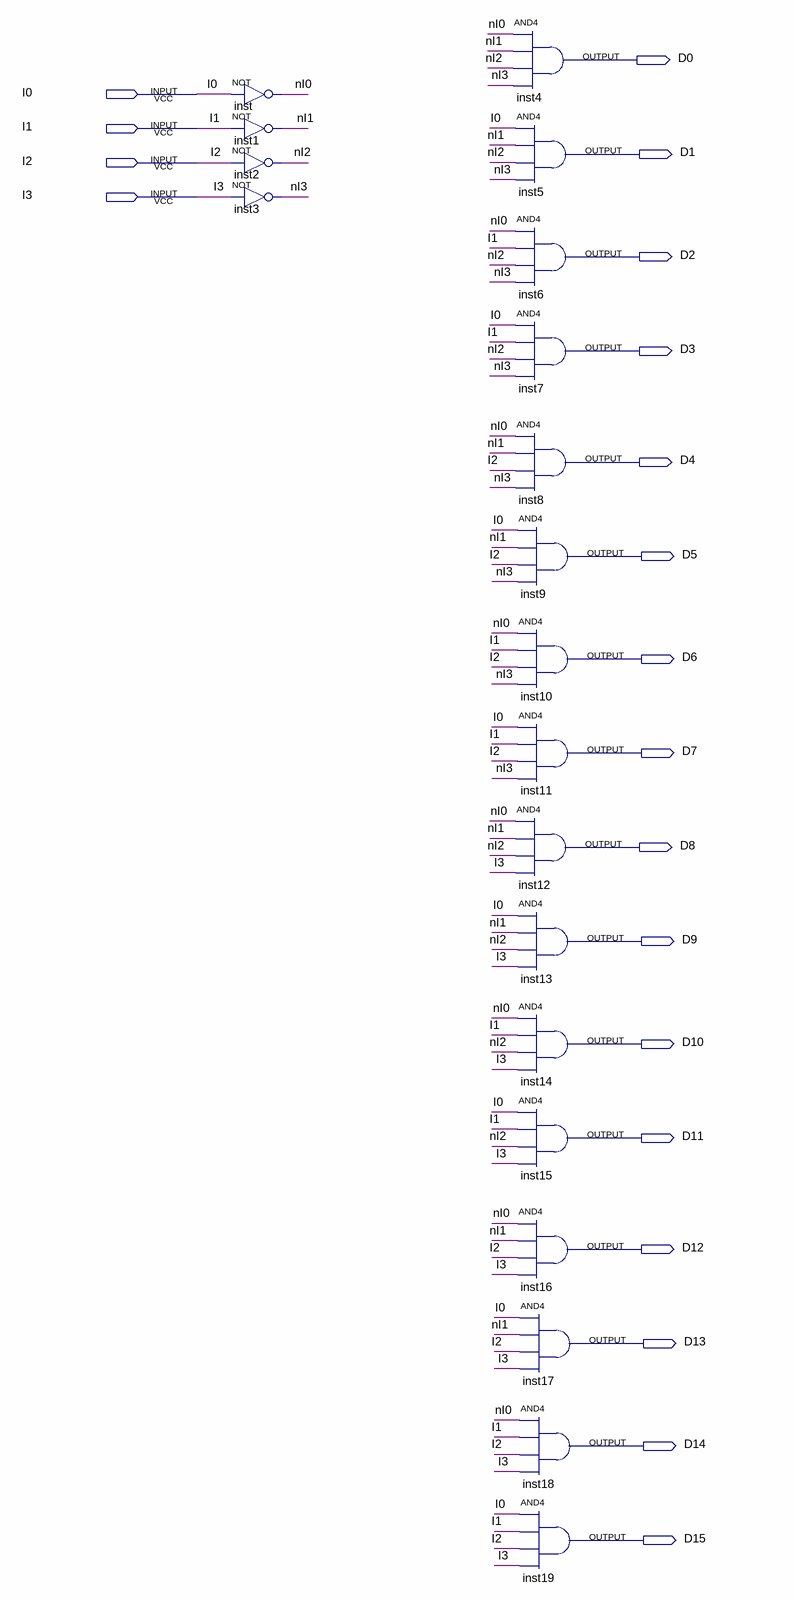
[diagram p0: schematic sheet]
// Quartus schematic DC16.bdf as structural Verilog: 20 symbols, 20 pins
module DC16 (
  input  I0,
  input  I1,
  input  I2,
  input  I3,
  output D0,
  output D1,
  output D2,
  output D3,
  output D4,
  output D5,
  output D6,
  output D7,
  output D8,
  output D9,
  output D10,
  output D11,
  output D12,
  output D13,
  output D14,
  output D15
);

  wire nI0, nI1, nI2, nI3;

  not inst (nI0, I0);
  not inst1 (nI1, I1);
  not inst2 (nI2, I2);
  not inst3 (nI3, I3);
  and inst4 (D0, nI0, nI1, nI2, nI3);
  and inst5 (D1, I0, nI1, nI2, nI3);
  and inst6 (D2, nI0, I1, nI2, nI3);
  and inst7 (D3, I0, I1, nI2, nI3);
  and inst8 (D4, nI0, nI1, I2, nI3);
  and inst9 (D5, I0, nI1, I2, nI3);
  and inst10 (D6, nI0, I1, I2, nI3);
  and inst11 (D7, I0, I1, I2, nI3);
  and inst12 (D8, nI0, nI1, nI2, I3);
  and inst13 (D9, I0, nI1, nI2, I3);
  and inst14 (D10, nI0, I1, nI2, I3);
  and inst15 (D11, I0, I1, nI2, I3);
  and inst16 (D12, nI0, nI1, I2, I3);
  and inst17 (D13, I0, nI1, I2, I3);
  and inst18 (D14, nI0, I1, I2, I3);
  and inst19 (D15, I0, I1, I2, I3);
endmodule
